# Altium schematic sheet clk_supply.SchDoc: =ProjectName
size 420 x 297 mm; Author: T.P.; CompanyName: WUT; DrawnBy: T.P.; Organization: WUT ISE; Address1: Warsaw Univeristy of Technology; Address2: Nowowiejska 15/19; DocumentNumber: 25; Revision: 0.9; SheetNumber: 25; SheetTotal: 36; EDA_Number: ARTIQ; Projet: ARTIQ/SINARA; ModifiedBy: -; CreateDate: XX/XX/XXXX; CheckedDate: -; Title2: clk_supply.SchDoc; DivGrp: ISE; Designer: G.K. and T.P.; ModifiedDate: -; ProjectName: ADC/DAC MEZZANINE
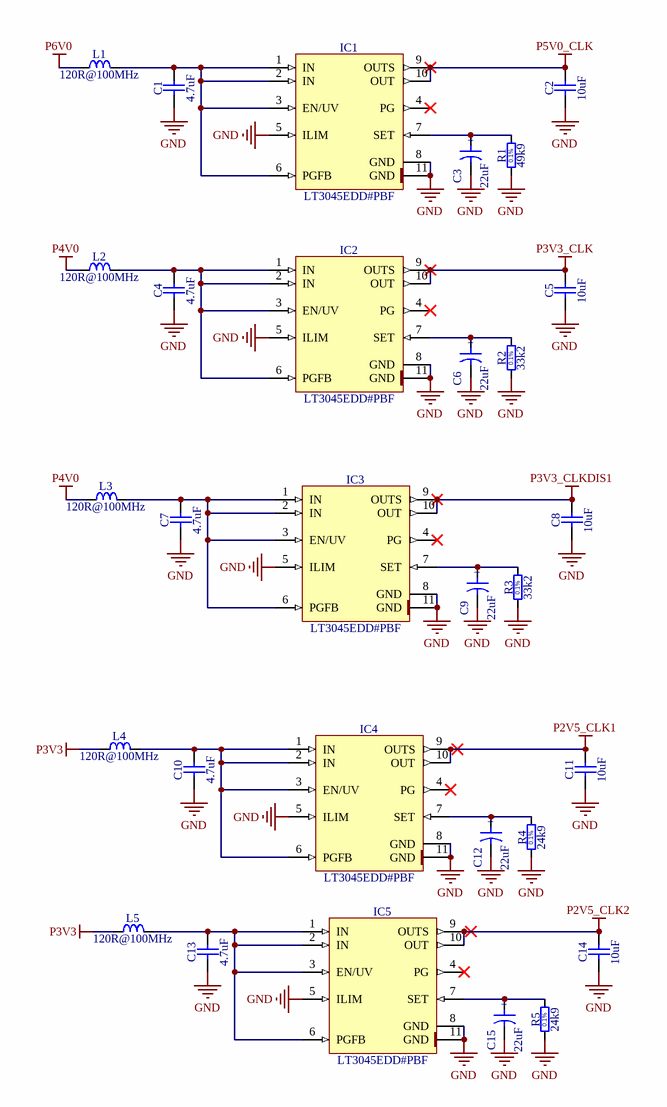
[diagram p0: clk_supply.SchDoc]

## Parts
C1  4.7uF  [CAPC1608X90N]
C2  10uF  [CAPC1608X87N]
C3  22uF  [CAPMP3216X180N]
C4  4.7uF  [CAPC1608X90N]
C5  10uF  [CAPC1608X87N]
C6  22uF  [CAPMP3216X180N]
C7  4.7uF  [CAPC1608X90N]
C8  10uF  [CAPC1608X87N]
C9  22uF  [CAPMP3216X180N]
C10  4.7uF  [CAPC1608X90N]
C11  10uF  [CAPC1608X87N]
C12  22uF  [CAPMP3216X180N]
C13  4.7uF  [CAPC1608X90N]
C14  10uF  [CAPC1608X87N]
C15  22uF  [CAPMP3216X180N]
IC1  LT3045EDD#PBF  [SON50P300X300X80-11N-R175X248]
IC2  LT3045EDD#PBF  [SON50P300X300X80-11N-R175X248]
IC3  LT3045EDD#PBF  [SON50P300X300X80-11N-R175X248]
IC4  LT3045EDD#PBF  [SON50P300X300X80-11N-R175X248]
IC5  LT3045EDD#PBF  [SON50P300X300X80-11N-R175X248]
L1  120R@100MHz  [INDC1608X95N]
L2  120R@100MHz  [INDC1608X95N]
L3  120R@100MHz  [INDC1608X95N]
L4  120R@100MHz  [INDC1608X95N]
L5  120R@100MHz  [INDC1608X95N]
R1  49k9  [RESC1608X55N]
R2  33k2  [RESC1608X55N]
R3  33k2  [RESC1608X55N]
R4  24k9  [RESC1608X55N]
R5  24k9  [RESC1608X55N]

## Nets
GND: C1.1 C2.1 C3.2 C4.1 C5.1 C6.2 C7.1 C8.1 C9.2 C10.1 C11.1 C12.2 C13.1 C14.1 C15.2 IC1.5(ILIM) IC1.8(GND) IC1.11(GND) IC2.5(ILIM) IC2.8(GND) IC2.11(GND) IC3.5(ILIM) IC3.8(GND) IC3.11(GND) IC4.5(ILIM) IC4.8(GND) IC4.11(GND) IC5.5(ILIM) IC5.8(GND) IC5.11(GND) R1.1 R2.1 R3.1 R4.1 R5.1
P2V5_CLK1: C11.2 IC4.9(OUTS) IC4.10(OUT)
P2V5_CLK2: C14.2 IC5.9(OUTS) IC5.10(OUT)
P3V3: L4.1 L5.1
P3V3_CLK: C5.2 IC2.9(OUTS) IC2.10(OUT)
P3V3_CLKDIS1: C8.2 IC3.9(OUTS) IC3.10(OUT)
P4V0: L2.1 L3.1
P5V0_CLK: C2.2 IC1.9(OUTS) IC1.10(OUT)
P6V0: L1.1
NetC1_2: C1.2 IC1.1(IN) IC1.2(IN) IC1.3(EN/UV) IC1.6(PGFB) L1.2
NetC3_1: C3.1 IC1.7(SET) R1.2
NetC4_2: C4.2 IC2.1(IN) IC2.2(IN) IC2.3(EN/UV) IC2.6(PGFB) L2.2
NetC6_1: C6.1 IC2.7(SET) R2.2
NetC7_2: C7.2 IC3.1(IN) IC3.2(IN) IC3.3(EN/UV) IC3.6(PGFB) L3.2
NetC9_1: C9.1 IC3.7(SET) R3.2
NetC10_2: C10.2 IC4.1(IN) IC4.2(IN) IC4.3(EN/UV) IC4.6(PGFB) L4.2
NetC12_1: C12.1 IC4.7(SET) R4.2
NetC13_2: C13.2 IC5.1(IN) IC5.2(IN) IC5.3(EN/UV) IC5.6(PGFB) L5.2
NetC15_1: C15.1 IC5.7(SET) R5.2

Not connected (* = marked no-connect by the designer): IC1 4(PG)*; IC2 4(PG)*; IC3 4(PG)*; IC4 4(PG)*; IC5 4(PG)*

## Notes on the sheet
- Project/Equipment
- Document
- Designer
- Drawn by
- Check.by
- File
- Last Mod.
- Print Date
- Sheet
- Size
- A3
- of
- Rev
- (in symbol CTE3216-18_22UF_6.3V_10%_LESR0900) +
- (in symbol R0603_24K9_0.1%_0.063W_10PPM) 0.1%
- (in symbol R0603_33K2_0.1%_0.063W_10PPM) 0.1%
- (in symbol R0603_49K9_0.1%_0.063W_10PPM) 0.1%

## Library data of the parts
C1 C4 C7 C10 C13 = CC0603_4.7UF_25V_10%_X5R: Non-polarised capacitor; Part Description: SMD Multilayer Chip Ceramic Capacitor; Manufacturer: GENERIC; Manufacturer1 Part Number: GRM188R61E475KE11D; Voltage: 25V; TC: X5R; Tolerance: ±10%; Part Number: CC0603_4.7UF_25V_10%_X5R; Component Kind: Standard; Component Type: Standard; Pin Count: 2; Value: 4.7uF; Status: None; Manufacturer Part Number: CC0603_4.7UF_25V_10%_X5R; Case: 0603; Mounted: Yes; Socket: No; SMD: Yes; Sense: No; Manufacturer1 Example: MURATA; Manufacturer1 ComponentHeight: 0.95mm; HelpURL: \\cern.ch\dfs\Applications\Altium\Datasheets\CC0603_MURATA_GRM188R61E475KE11D.pdf; Author: CERN DEM JLC; CreateDate: 10.11.2014; LatestRevisionDate: 10.11.2014
C2 C5 C8 C11 C14 = CC0603_10UF_6.3V_20%_X5R: Non-polarised capacitor; Part Description: SMD Multilayer Chip Ceramic Capacitor; Manufacturer: GENERIC; Manufacturer1 Part Number: C0603C106M9PAC; Voltage: 6.3V; TC: X5R; Tolerance: ±20%; Part Number: CC0603_10UF_6.3V_20%_X5R; Component Kind: Standard; Component Type: Standard; Pin Count: 2; Value: 10uF; Status: Preferred; Manufacturer Part Number: CC0603_10uF_6.3V_20%_X5R; Case: 0603; Mounted: Yes; Socket: No; SMD: Yes; Sense: No; Manufacturer1 Example: KEMET; Manufacturer1 ComponentHeight: 0.95mm; HelpURL: \\cern.ch\dfs\Applications\Altium\Datasheets\CC0603_X5R_KEMET.pdf; Author: CERN DEM JLC; CreateDate: 03.12.2007; LatestRevisionDate: 03.12.2007
C3 C6 C9 C12 C15 = CTE3216-18_22UF_6.3V_10%_LESR0900: Polarised capacitor; Part Description: Low ESR 0R9 Solid Tantalum Chip Capacitor; Manufacturer: GENERIC; Manufacturer1 Part Number: TPSA226K006R0900; Voltage: 6.3V; Tolerance: ±10%; Part Number: CTE3216-18_22UF_6.3V_10%_LESR0900; Component Kind: Standard; Component Type: Standard; Pin Count: 2; Value: 22uF; Status: Preferred; Manufacturer Part Number: CTE3216-18_22UF_6.3V_10%_LESR0900; Case: A; Mounted: Yes; Socket: No; SMD: Yes; Sense: No; Manufacturer1 Example: AVX; Manufacturer1 ComponentHeight: 1.8mm; HelpURL: \\cern.ch\dfs\Applications\Altium\Datasheets\CTE-LESR_AVX_TPS.pdf; Author: CERN DEM JLC; CreateDate: 05.05.2008; LatestRevisionDate: 20.01.2009
IC1-IC5 = LT3045EDD#PBF: 20V, 500mA, Ultralow Noise, Ultrahigh PSRR Linear Regulator; Manufacturer: LINEAR TECHNOLOGY; PressFit: No; Bonding: No; Part Number: LT3045EDD#PBF; Component Kind: Standard; Component Type: Standard; Device: LT3045EDD#PBF; PackageDescription: SON, 0.50mm Pitch, 10-pin, 3.00mm W  X 3.00mm L X 0.80mm Height, (w/thermal tab 1.75 X 2.48 mm), IPC Medium Density; Part Description: 20V, 500mA, Ultralow Noise, Ultrahigh PSRR Linear Regulator; Manufacturer Part Number: LT3045EDD#PBF; Pin Count: 11; Case: SON10; Mounted: Yes; Socket: No; SMD: Yes; Sense: No; ComponentHeight: 0.8mm; HelpURL: \\cern.ch\dfs\Applications\Altium\Datasheets\LT3045EDD#PBF.pdf; Author: CERN DEM JLC; CreateDate: 07.12.2016; LatestRevisionDate: 07.12.2016
L1-L5 = IND0603_MURATA_BLM18PG121SN1D: Inductor; Part Description: SMD EMIFIL Chip Ferrite Bead; Manufacturer: MURATA; Power: 2A; Resistance: 0.05R; Part Number: IND0603_MURATA_BLM18PG121SN1D; Component Kind: Standard; Component Type: Standard; Pin Count: 2; Value: 120R@100MHz; Status: None; Manufacturer Part Number: BLM18PG121SN1D; Case: 0603; Mounted: Yes; Socket: No; SMD: Yes; Sense: No; ComponentHeight: 0.95mm; HelpURL: \\cern.ch\dfs\Applications\Altium\Datasheets\IND0603_MURATA_BLM18P.pdf; Author: CERN DEM BC; CreateDate: 27.07.2015; LatestRevisionDate: 27.07.2015
R1 = R0603_49K9_0.1%_0.063W_10PPM: Resistor - 0.1%; Part Description: Thin Film Chip Resistor; Manufacturer: GENERIC; Manufacturer1 Part Number: RN73C1J49K9BTDF; Power: 0.063W; TC: ±10ppm; PressFit: No; Part Number: R0603_49K9_0.1%_0.063W_10PPM; Component Kind: Standard; Component Type: Standard; Pin Count: 2; Value: 49k9; Status: Not Recommended; Tolerance: ±0.1%; Manufacturer Part Number: R0603_49K9_0.1%_0.063W_10PPM; Case: 0603; Mounted: Yes; Sense: No; Socket: No; SMD: Yes; Manufacturer1 Example: TYCO HOLSWORTHY; Manufacturer1 ComponentHeight: 0.5mm; HelpURL: \\cern.ch\dfs\Applications\Altium\Datasheets\R0603_Tyco_RN73.pdf; Author: CERN DEM JLC; CreateDate: 03.12.2007; LatestRevisionDate: 13.03.2008
R2 R3 = R0603_33K2_0.1%_0.063W_10PPM: Resistor - 0.1%; Part Description: Thin Film Chip Resistor; Manufacturer: GENERIC; Manufacturer1 Part Number: RN73C1J33K2BTDF; Power: 0.063W; TC: ±10ppm; PressFit: No; Part Number: R0603_33K2_0.1%_0.063W_10PPM; Component Kind: Standard; Component Type: Standard; Pin Count: 2; Value: 33k2; Status: Not Recommended; Tolerance: ±0.1%; Manufacturer Part Number: R0603_33K2_0.1%_0.063W_10PPM; Case: 0603; Mounted: Yes; Sense: No; Socket: No; SMD: Yes; Manufacturer1 Example: TYCO HOLSWORTHY; Manufacturer1 ComponentHeight: 0.5mm; HelpURL: \\cern.ch\dfs\Applications\Altium\Datasheets\R0603_Tyco_RN73.pdf; Author: CERN DEM JLC; CreateDate: 03.12.2007; LatestRevisionDate: 13.03.2008
R4 R5 = R0603_24K9_0.1%_0.063W_10PPM: Resistor - 0.1%; Part Description: Thin Film Chip Resistor; Manufacturer: GENERIC; Manufacturer1 Part Number: RN73C1J24K9BTDF; Power: 0.063W; TC: ±10ppm; PressFit: No; Part Number: R0603_24K9_0.1%_0.063W_10PPM; Component Kind: Standard; Component Type: Standard; Pin Count: 2; Value: 24k9; Status: Not Recommended; Tolerance: ±0.1%; Manufacturer Part Number: R0603_24K9_0.1%_0.063W_10PPM; Case: 0603; Mounted: Yes; Sense: No; Socket: No; SMD: Yes; Manufacturer1 Example: TYCO HOLSWORTHY; Manufacturer1 ComponentHeight: 0.5mm; HelpURL: \\cern.ch\dfs\Applications\Altium\Datasheets\R0603_Tyco_RN73.pdf; Author: CERN DEM JLC; CreateDate: 03.12.2007; LatestRevisionDate: 13.03.2008